# Altium schematic sheet SAWS Connection Diagram.SchDoc
size A
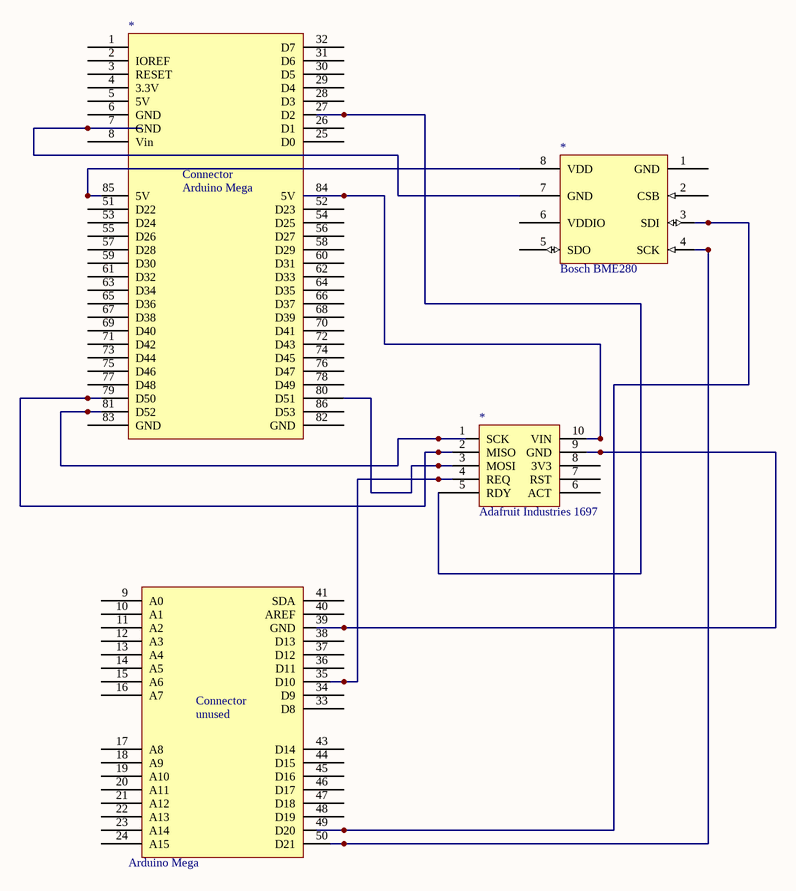
[diagram p0: SAWS Connection Diagram.SchDoc]

## Parts
(Parts that share a designator on the sheet are numbered #1, #2 ... from top to bottom, then left to right.)
*#1  Bosch BME280  [LGA-8]
*#2  Arduino Mega  [TFT_Shield_MEGA]
*#3  Adafruit Industries 1697  [PCB-jbwx2r95ohr5pnaey095-1]

## Nets
Net*#1_3: *#1.3(SDI) *#2.49(D20)
Net*#1_4: *#1.4(SCK) *#2.50(D21)
Net*#1_7: *#1.7(GND) *#2.7(GND)
Net*#1_8: *#1.8(VDD) *#2.85(5V)
Net*#2_27: *#2.27(D2) *#3.5(RDY)
Net*#2_35: *#2.35(D10) *#3.4(REQ)
Net*#2_39: *#2.39(GND) *#3.9(GND)
Net*#2_79: *#2.79(D50) *#3.2(MISO)
Net*#2_80: *#2.80(D51) *#3.3(MOSI)
Net*#2_81: *#2.81(D52) *#3.1(SCK)
Net*#2_84: *#2.84(5V) *#3.10(VIN)

Not connected (* = marked no-connect by the designer): *#1 1(GND) 2(CSB) 5(SDO) 6(VDDIO); *#2 1 2(IOREF) 3(RESET) 4(3.3V) 5(5V) 6(GND) 8(Vin) 9(A0) 10(A1) 11(A2) 12(A3) 13(A4) 14(A5) 15(A6) 16(A7) 17(A8) 18(A9) 19(A10) 20(A11) 21(A12) 22(A13) 23(A14) 24(A15) 25(D0) 26(D1) 28(D3) 29(D4) 30(D5) 31(D6) 32(D7) 33(D8) 34(D9) 36(D11) 37(D12) 38(D13) 40(AREF) 41(SDA) 43(D14) 44(D15) 45(D16) 46(D17) 47(D18) 48(D19) 51(D22) 52(D23) 53(D24) 54(D25) 55(D26) 56(D27) 57(D28) 58(D29) 59(D30) 60(D31) 61(D32) 62(D33) 63(D34) 64(D35) 65(D36) 66(D37) 67(D38) 68(D39) 69(D40) 70(D41) 71(D42) 72(D43) 73(D44) 74(D45) 75(D46) 76(D47) 77(D48) 78(D49) 82(GND) 83(GND) 86(D53); *#3 6(ACT) 7(RST) 8(3V3)

## Notes on the sheet
- (in symbol ARDUINO MEGA2560 REV3) Connector; unused

## Library data of the parts
*#1 = BME280: Combined humidity and pressure sensor; Lead-Free Status: Lead Free; Octopart Url: https://octopart.com/bme280-bosch-52931981; OctopartID: a1c26bef29297e05; RoHS: Compliant
*#2 = ARDUINO MEGA2560 REV3: Sainsmart, TFT LCD Mega Shield, V1.0, Arduino Mega 2560; Shop: http://www.sainsmart.com/sainsmart-tft-lcd-adjustable-shield-for-arduino-mega-2560-r3-1280-a082-plug.html; OctopartID: 0ba5c1fab996d462
*#3 = 1697: Micro Jack; Solder Mount Jack; Length .233; Pin Size .022-.032; Brass/Gold; Manufacturer Part Number: 1697; Output Voltage: 40.0 V; Power Rating: 200 W; Size-Width: 193 mm; OctopartID: 792bb2f1ef18a6ec; Size-Length: 215 mm; Size-Height: 98.0 mm; Octopart URL: http://octopart.com/1697-adafruit+industries-47231829